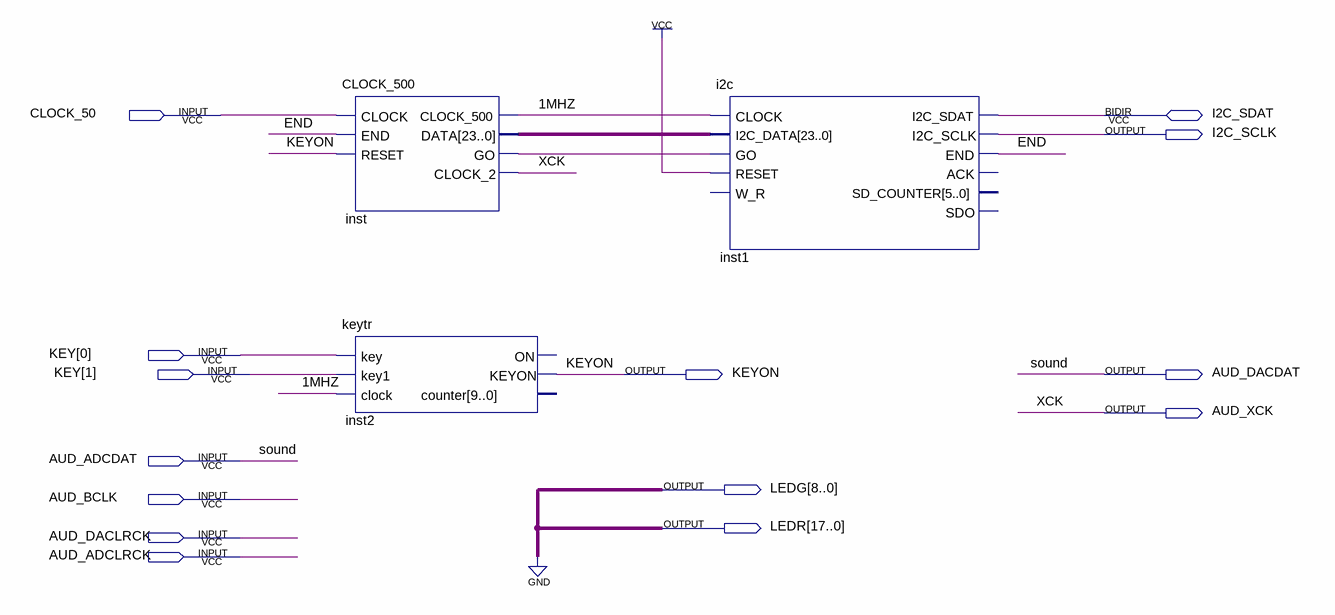
[diagram p0: schematic sheet]
// Quartus schematic DE2_115_i2sound.bdf as structural Verilog: 3 symbols, 14 pins
module DE2_115_i2sound (
  input  CLOCK_50,
  input  [1:0] KEY,
  input  AUD_ADCDAT,
  input  AUD_BCLK,
  input  AUD_DACLRCK,
  input  AUD_ADCLRCK,
  inout  I2C_SDAT,
  output I2C_SCLK,
  output KEYON,
  output AUD_DACDAT,
  output AUD_XCK,
  output [8:0] LEDG,
  output [17:0] LEDR
);

  wire \1MHZ , END, inst_go;
  wire [23:0] inst_data;

  CLOCK_500 inst (
    .CLOCK(CLOCK_50), .END(END), .RESET(KEYON), .CLOCK_500(\1MHZ ), .DATA(inst_data), .GO(inst_go),
    .CLOCK_2(AUD_XCK));
  keytr inst2 (.key(KEY[0]), .key1(KEY[1]), .clock(\1MHZ ), .KEYON(KEYON));  // open: ON, counter
  i2c inst1 (
    .CLOCK(\1MHZ ), .I2C_DATA(inst_data), .GO(inst_go), .RESET(1'b1), .I2C_SCLK(I2C_SCLK), .END(END),
    .I2C_SDAT(I2C_SDAT));  // open: W_R, ACK, SD_COUNTER, SDO

  assign AUD_DACDAT = AUD_ADCDAT;
  assign LEDR = {18{1'b0}};

  // Other names for the same wires on the sheet: sound = AUD_ADCDAT; XCK = AUD_XCK
endmodule
